# Altium schematic sheet Power.SchDoc
size A4; SheetNumber: 4; SheetTotal: 4
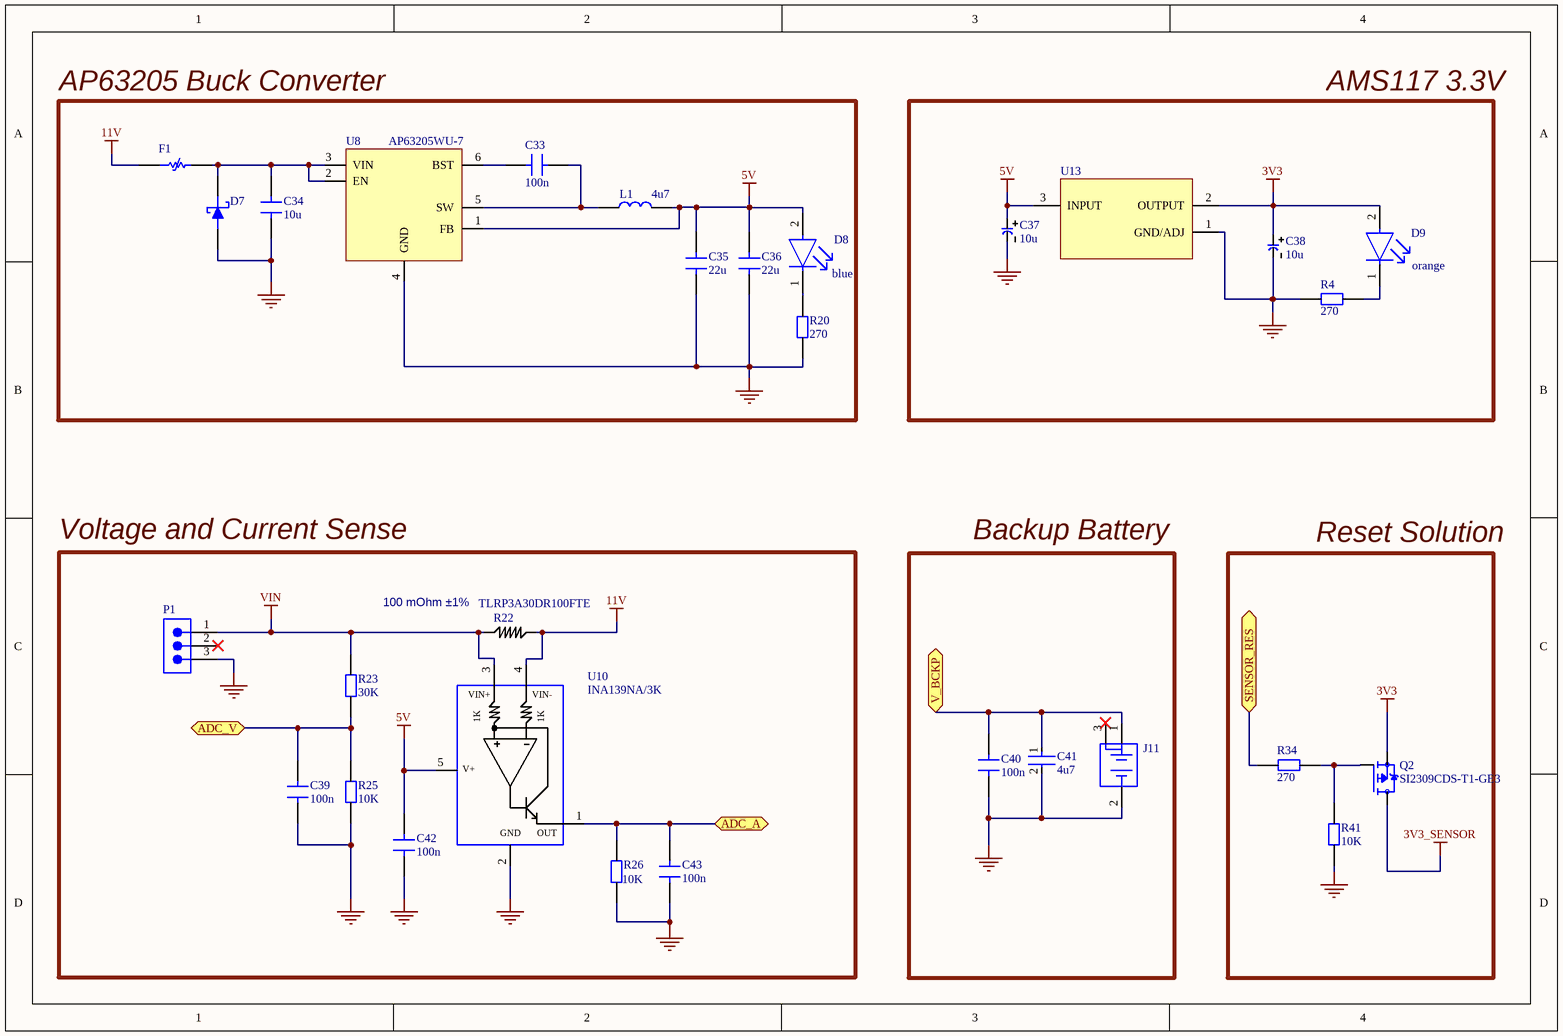
[diagram p0: Power.SchDoc]

## Parts
C33  100n  [CAP 0805]
C34  10u  [CAP 1210]
C35  22u  [CAP 1210]
C36  22u  [CAP 1210]
C37  10u  [T491A106M020AT]
C38  10u  [T491A106M020AT]
C39  100n  [CAP 0805]
C40  100n  [CAP 0603]
C41  4u7  [FP-1206-L_3_2_0_2-W_1_6_0-IPC_A]
C42  100n  [CAP 0805]
C43  100n  [CAP 0805]
D7  SMBJ14CA  [SMBJ12CA-13-F]  (value not drawn)
D8  blue  [FP-LTST-C170TBKT-MFG]
D9  orange  [FP-LTST-C170KFKT-MFG]
F1  MF-MSMF075/24-2  [0ZCG0075FF2C]  (value not drawn)
J11  S8201-46R  [S8201-46R]  (value not drawn)
L1  4u7  [IHLP2020CZER4R7M11]
P1  691382030003  [691382030003]  (value not drawn)
Q2  SI2309CDS-T1-GE3  [SI2309CDS-T1-GE3]
R4  270  [RES 0805]
R20  270  [RES 0805]
R22  TLRP3A30DR100FTE  [RES 2512]
R23  30K  [RES 0805]
R25  10K  [RES 0805]
R26  10K  [RES 0805]
R34  270  [RES 0603]
R41  10K  [RES 0603]
U8  AP63205WU-7  [AP63205]
U10  INA139NA/3K  [INA139NA]
U13  AMS111733TR-HT_SOT223  [AMS111733TR-HT_SOT223]  (value not drawn)

## Blocks framed on the sheet
AP63205 Buck Converter: C33-C36 D7 D8 F1 L1 R20 U8
AMS117 3.3V: C37 C38 D9 R4 U13
Voltage and Current Sense: C39 C42 C43 P1 R22 R23 R25 R26 U10
Backup Battery: C40 C41 J11
Reset Solution: Q2 R34 R41

## Ports
ADC_A (bidir, see MCU[4C]), ADC_V (bidir, see MCU[4B]), SENSOR_RES (bidir, see MCU[6B]), V_BCKP (bidir, see MCU[6B], Peripherals[2A])

## Nets
3V3: C38.POS D9.2(A) Q2.2(S) U13.2(OUTPUT)
3V3_SENSOR: Q2.3(D)
5V: C35.2 C36.2 C37.POS C42.2 D8.2(A) L1.2 U8.1(FB) U10.5(V+) U13.3(INPUT)
11V: F1.1 R22.1 U10.4(VIN+)
GND: C34.1 C35.1 C36.1 C37.NEG C38.NEG C39.1 C40.1 C41.2 C42.1 C43.1 D7.1 J11.2(-) P1.3 R4.2 R20.1 R25.1 R26.1 R41.1 U8.4(GND) U10.2(GND) U13.1(GND/ADJ)
VIN: P1.1 R22.2 R23.2 U10.3(VIN+)
ADC_A: C43.2 R26.2 U10.1(OUT) ; port ADC_A
ADC_V: C39.2 R23.1 R25.2 ; port ADC_V
SENSOR_RES: R34.1 ; port SENSOR_RES
V_BCKP: C40.2 C41.1 J11.1(+) ; port V_BCKP
NetC33_1: C33.1 L1.1 U8.5(SW)
NetC33_2: C33.2 U8.6(BST)
NetC34_2: C34.2 D7.2 F1.2 U8.2(EN) U8.3(VIN)
NetD8_1: D8.1(C) R20.2
NetD9_1: D9.1(C) R4.1
NetQ2_1: Q2.1(G) R34.2 R41.2

Not connected (* = marked no-connect by the designer): J11 3(+)*; P1 2*

## Notes on the sheet
- (near R22) 100 mOhm ±1%
- (in symbol INA139NA/3K) VIN-; 1K

## Library data of the parts
C33 C39 C42 C43 = CAP 0805 50V: Capacitor SMD 0805 50V
C34 = CAP 1210 50V: Capacitor SMD 1210 50V
C35 C36 = CAP 1210 25V: Capacitor SMD 1210 25V
C37 C38 = T491A106M020AT
C40 = CAP 0603 50V: Capacitor SMD 0603 50V
C41 = CMP-14477-000781-2: None; Capacitance: 4.7uF; Voltage Rating: 50V; Tolerance: 20%; Min Operating Temperature: -55°C; RoHS Compliant: Yes; Case/Package: 1206; Mount: Surface Mount; Packaging: Tape and Reel; Max Operating Temperature: 85°C; Ratings: AEC-Q200
D7 = SMBJ14CA: TVS DIODE 14VWM 23.2VC DO214AA; Manufacturer: Littelfuse; Operating Supply Voltage: 14V; Max Surge Current: 25.9A; Number of Channels: 1; Polarity: Bidirectional; Breakdown Voltage: 15.6V; Clamping Voltage: 23.2V; Peak Pulse Power: 600W; Power Line Protection: No; Test Current: 1mA; Leakage Current: 1uA; Diode Type: ZENER; Max Breakdown Voltage: 17.2V; Supplier 1: Future Electronics; Manufacturer Part Number: SMBJ14CA; RoHS: Yes; Category: TVS Diodes; Stock 1: 1300; Pricing 1: 1=0,36, 15=0,29, 75=0,245, 300=0,205, 1500=0,163 (USD); Mount: Surface Mount; Case/Package: DO-214AA; Number of Pins: 2; Weight: 0.00328oz; Min Operating Temperature: -65°C; Max Operating Temperature: 150°C; Packaging: Tape and Reel; Package Quantity: 3000; Reverse Breakdown Voltage: 15.6V; Number of Bidirectional Channels: 1; Reverse Standoff Voltage: 14V; Min Breakdown Voltage: 15.6V; Number of Elements: 1; Peak Pulse Current: 25.9A; Voltage Rating (DC): 14V; Series: SMBJ; Direction: Bidirectional; Termination: SMD/SMT; Max Power Dissipation: 600W; Power Dissipation: 600W; Current: 1mA; Voltage: 14V; Clamping Voltage-Max: 23.2V; Length: 5.59mm; Width: 3.94mm; Height: 2.44mm; RoHS Compliant: Yes; Lead Free: Lead Free; Reach SVHC Compliant: No; ComponentLink1URL: https://datasheet.ciiva.com/331/littelfuse-tvs-diode-smbj-datasheet-pdf-331530.pdf?src-supplier=Digikey; ComponentLink1Description: https://datasheet.ciiva.com/331/littelfuse-tvs-diode-smbj-datasheet-pdf-331530.pdf?src-supplier=Digikey; ComponentLink2URL: https://datasheet.ciiva.com/331/littelfuse-tvs-diode-smbj-datasheet-pdf-331531.pdf?src-supplier=Digikey; ComponentLink2Description: https://datasheet.ciiva.com/331/littelfuse-tvs-diode-smbj-datasheet-pdf-331531.pdf?src-supplier=Digikey; ComponentLink3URL: https://datasheet.ciiva.com/331/littelfuse-tvs-diode-smbj-datasheet-pdf-331529.pdf?src-supplier=Digikey; ComponentLink3Description: https://datasheet.ciiva.com/331/littelfuse-tvs-diode-smbj-datasheet-pdf-331529.pdf?src-supplier=Digikey
D8 = CMP-22017-000023-1: LED BLUE CLEAR SMD; Luminous Intensity: 180mcd; Number of LEDs: 1; Lens Style: Diffused; Power Rating: 76mW; Lens Color: Colorless; Forward Voltage: 3.8V; Viewing Angle: 130°; Reverse Voltage: 5V; Forward Current: 20mA; Dominant Wavelength: 475nm; Wavelength: 468nm; Radiation Hardening: No; Illumination Color: Blue; Case Code (Metric): 2012; Max Operating Temperature: 80°C; Case Code (Imperial): 0805; Min Operating Temperature: -20°C; Height: 1.1mm; Color: Blue; Package Quantity: 1; Lens Transparency: Clear; Number of Pins: 2; Lead Free: Lead Free; Mount: Surface Mount; Length: 2mm; Depth: 1.25mm; Number of Elements: 1; Case/Package: 0805; Power Dissipation: 76mW; Width: 1.25mm; Test Current: 20mA; Packaging: Tape and Reel
D9 = CMP-22017-000036-1: LED ORANGE CLEAR SMD; Forward Current: 30mA; Reverse Voltage: 5V; Forward Voltage: 2V; Lens Style: Diffused; Number of Elements: 1; Test Current: 20mA; Lens Color: Colorless; Viewing Angle: 130°; Dominant Wavelength: 605nm; Luminous Intensity: 60mcd; Power Rating: 75mW; Wavelength: 611nm; Min Operating Temperature: -55°C; Packaging: Tape and Reel; Case Code (Metric): 2012; Depth: 1.6mm; Case Code (Imperial): 0805; Mount: Surface Mount; Radiation Hardening: No; Lens Transparency: Clear; Color: Orange; Package Quantity: 1; Illumination Color: Orange; Lead Free: Lead Free; Number of LEDs: 1; Length: 3.2mm; Height: 1.1mm; Number of Pins: 2; Width: 1.25mm; Case/Package: 0805; Power Dissipation: 75mW; Max Operating Temperature: 85°C
F1 = MF-MSMF075/24-2: PTC Resettable Fuse 0.75A(hold) 1.5A(trip) 24V 40A 0.8W 0.2s 0.11Ohm SMD Solder Pad 1812 T/R Automotive; Manufacturer: Bourns; Supplier 1: Arrow Electronics; Manufacturer Part Number: MF-MSMF075/24-2; RoHS: Yes; Category: Fuses; Stock 1: 88000; Pricing 1: 4000=0,2686 (USD); Lead Free: 5697LeadFree; ComponentLink1URL: https://datasheet.ciiva.com/27091/1164226-27091560.pdf?src-supplier=Jameco; ComponentLink1Description: https://datasheet.ciiva.com/27091/1164226-27091560.pdf?src-supplier=Jameco; ComponentLink2URL: https://datasheet.ciiva.com/326/mfmsmf-326789.pdf?src-supplier=Digikey; ComponentLink2Description: https://datasheet.ciiva.com/326/mfmsmf-326789.pdf?src-supplier=Digikey; ComponentLink3URL: https://datasheet.ciiva.com/326/mfmsmf-326790.pdf?src-supplier=Digikey; ComponentLink3Description: https://datasheet.ciiva.com/326/mfmsmf-326790.pdf?src-supplier=Digikey; ComponentLink4URL: https://datasheet.ciiva.com/326/mfmsmf-326791.pdf?src-supplier=Digikey; ComponentLink4Description: https://datasheet.ciiva.com/326/mfmsmf-326791.pdf?src-supplier=Digikey; ComponentLink5URL: https://datasheet.ciiva.com/3019/mfmsmf-3019624.pdf?src-supplier=Avnet; ComponentLink5Description: https://datasheet.ciiva.com/3019/mfmsmf-3019624.pdf?src-supplier=Avnet; ComponentLink6URL: https://datasheet.ciiva.com/3019/mfmsmf-3019625.pdf?src-supplier=Avnet; ComponentLink6Description: https://datasheet.ciiva.com/3019/mfmsmf-3019625.pdf?src-supplier=Avnet; ComponentLink7URL: https://datasheet.ciiva.com/30254/575mfmsmf-30254266.pdf?src-supplier=Onlinecomponents.com; ComponentLink7Description: https://datasheet.ciiva.com/30254/575mfmsmf-30254266.pdf?src-supplier=Onlinecomponents.com; ComponentLink8URL: https://datasheet.ciiva.com/16205/mfmsmf-16205996.pdf?src-supplier=Onlinecomponents.com; ComponentLink8Description: https://datasheet.ciiva.com/16205/mfmsmf-16205996.pdf?src-supplier=Onlinecomponents.com; ComponentLink9URL: https://datasheet.ciiva.com/14539/70153434-14539177.pdf?src-supplier=Allied+Electronics; ComponentLink9Description: https://datasheet.ciiva.com/14539/70153434-14539177.pdf?src-supplier=Allied+Electronics; ComponentLink10URL: https://datasheet.ciiva.com/1228/1786007-1228156.pdf?src-supplier=Newark; ComponentLink10Description: https://datasheet.ciiva.com/1228/1786007-1228156.pdf?src-supplier=Newark; ComponentLink11URL: https://datasheet.ciiva.com/1274/1786007-1274502.pdf?src-supplier=Element14; ComponentLink11Description: https://datasheet.ciiva.com/1274/1786007-1274502.pdf?src-supplier=Element14; ComponentLink12URL: https://datasheet.ciiva.com/1274/1786007-1274503.pdf?src-supplier=Element14; ComponentLink12Description: https://datasheet.ciiva.com/1274/1786007-1274503.pdf?src-supplier=Element14
J11 = S8201-46R: Battery Holder, Coin Cell, 1225, Smd Rohs Compliant: Yes |Harwin S8201-46R; Manufacturer: Harwin; Number of Contacts: 2NUMBER; Supplier 1: Farnell; Manufacturer Part Number: S8201-46R; RoHS: Yes; Category: Connectors; Stock 1: 4494; Pricing 1: 1=0,926, 25=0,765, 75=0,589, 200=0,555, 500=0,48 (EUR); Contact Material: 153,154ConductorMaterial; Height: 3.25mm; ComponentLink1URL: https://datasheet.ciiva.com/4/s8201r-4048.pdf?src-supplier=Digikey; ComponentLink1Description: https://datasheet.ciiva.com/4/s8201r-4048.pdf?src-supplier=Digikey; ComponentLink2URL: https://datasheet.ciiva.com/4642/c0430120-20coin20cell20battery20retainers-55143-4642583.pdf?src-supplier=Mouser; ComponentLink2Description: https://datasheet.ciiva.com/4642/c0430120-20coin20cell20battery20retainers-55143-4642583.pdf?src-supplier=Mouser; ComponentLink3URL: https://datasheet.ciiva.com/1391/1458706-1391064.pdf?src-supplier=Element14; ComponentLink3Description: https://datasheet.ciiva.com/1391/1458706-1391064.pdf?src-supplier=Element14; ComponentLink4URL: https://datasheet.ciiva.com/4/s8201r-4049.pdf?src-supplier=Digikey; ComponentLink4Description: https://datasheet.ciiva.com/4/s8201r-4049.pdf?src-supplier=Digikey
L1 = IHLP2020CZER4R7M11: Inductor Power Shielded Wirewound 4.7uH 20% 100KHz Powdered Iron 4.5A 60mOhm DCR 2020 T/R; Manufacturer: Vishay; Supplier 1: Mouser; Manufacturer Part Number: IHLP2020CZER4R7M11; RoHS: No; Category: Fixed Inductors; Stock 1: 10031; Pricing 1: 1=1,19, 10=1,02, 50=1,02, 100=0,828, 1000=0,828, 10000=0,473 (USD); ComponentLink1URL: https://datasheet.ciiva.com/14803/lp20cz11-14803040.pdf?src-supplier=Arrow+Electronics; ComponentLink1Description: https://datasheet.ciiva.com/14803/lp20cz11-14803040.pdf?src-supplier=Arrow+Electronics; ComponentLink2URL: https://datasheet.ciiva.com/11798/0900766b8102c930-11798346.pdf?src-supplier=Rs; ComponentLink2Description: https://datasheet.ciiva.com/11798/0900766b8102c930-11798346.pdf?src-supplier=Rs; ComponentLink3URL: https://datasheet.ciiva.com/22694/480942-22694470.pdf?src-supplier=Element14; ComponentLink3Description: https://datasheet.ciiva.com/22694/480942-22694470.pdf?src-supplier=Element14; ComponentLink4URL: https://datasheet.ciiva.com/8017/480942-8017228.pdf?src-supplier=Element14; ComponentLink4Description: https://datasheet.ciiva.com/8017/480942-8017228.pdf?src-supplier=Element14; ComponentLink5URL: https://datasheet.ciiva.com/8494/lp20cz11-8494950.pdf?src-supplier=Avnet; ComponentLink5Description: https://datasheet.ciiva.com/8494/lp20cz11-8494950.pdf?src-supplier=Avnet; ComponentLink6URL: https://datasheet.ciiva.com/17112/70205433-17112327.pdf?src-supplier=Allied+Electronics; ComponentLink6Description: https://datasheet.ciiva.com/17112/70205433-17112327.pdf?src-supplier=Allied+Electronics; ComponentLink7URL: https://datasheet.ciiva.com/6688/lp20cz11-6688326.pdf?src-supplier=Digikey; ComponentLink7Description: https://datasheet.ciiva.com/6688/lp20cz11-6688326.pdf?src-supplier=Digikey; ComponentLink8URL: https://datasheet.ciiva.com/6688/lp20cz11-6688327.pdf?src-supplier=Digikey; ComponentLink8Description: https://datasheet.ciiva.com/6688/lp20cz11-6688327.pdf?src-supplier=Digikey; ComponentLink9URL: https://datasheet.ciiva.com/6688/lp20cz11-6688329.pdf?src-supplier=Digikey; ComponentLink9Description: https://datasheet.ciiva.com/6688/lp20cz11-6688329.pdf?src-supplier=Digikey
P1 = CMP-1502-01752-2: NexarPartId: 52676071; Current: 12A; Number of Levels: 1; Voltage: 300V; Pitch: 2.4892mm; Number of Positions: 3; Gender: Male; Mount: Through Hole; Contact Plating: Tin; Color: Green; Orientation: Vertical; Max Operating Temperature: 105°C; RoHS: Compliant; Min Operating Temperature: -40°C; Lead Pitch: 2.5mm; Termination: Solder; Packaging: Box; Number of Positions Per Level: 3; Number of Pins: 3
Q2 = SI2309CDS-T1-GE3: MOSFET, P-CH, Vds -60V, Vgs +/- 20V, Rds(on) 285mohm, Id 1.6A, SOT-23, Pd 1.7W | Siliconix / Vishay SI2309CDS-T1-GE3; MF: Vishay Siliconix; SnapEDA_Link: https://www.snapeda.com/parts/SI2309CDS-T1-GE3/Vishay+Siliconix/view-part/?ref=snap; Package: SOT-23-3 Vishay Siliconix; Value: *; MP: SI2309CDS-T1-GE3; Check_prices: https://www.snapeda.com/parts/SI2309CDS-T1-GE3/Vishay+Siliconix/view-part/?ref=eda
R4 R20 R23 R25 R26 = RES 0805: Resistor SMD 0805
R22 = TLRP3A30DR100FTE: Res, 0R1, 1%, 3W, Metal Strip, SMD Rohs Compliant: Yes; Manufacturer: TE Connectivity; Supplier 1: Farnell; Manufacturer Part Number: TLRP3A30DR100FTE; RoHS: No; Category: Chip SMD Resistors; Stock 1: 1580; Pricing 1: 10=0,393, 100=0,273, 500=0,221, 1000=0,179, 2000=0,177, 4000=0,166, 20000=0,163, 40000=0,159 (EUR)
R34 R41 = RES 0603: Resistor SMD 0603
U8 = AP63205WU-7: AP63205 Series 32 V 2 A 1.1 MHz Synchronous Buck Converter -TSOT-26; Manufacturer: Diodes; Max Duty Cycle: 100%; Max Supply Voltage: 32V; Min Supply Voltage: 3.8V; Nominal Supply Current: 22uA; Number of Outputs: 1NUMBER; Output Current: 2A; Output Voltage: 5V; Switching Frequency: 1.1MHz; Supplier 1: Future Electronics; Manufacturer Part Number: AP63205WU-7; RoHS: Yes; Category: Voltage Regulators - Switching; Stock 1: 45000; Pricing 1: 3000=0,33, 6000=0,32 (USD); Min Operating Temperature: -40°C; Max Operating Temperature: 85°C; Height: 1mm; ComponentLink1URL: https://www.diodes.com/assets/Datasheets/AP63200-AP63201-AP63203-AP63205.pdf?src-supplier=Digikey; ComponentLink1Description: https://www.diodes.com/assets/Datasheets/AP63200-AP63201-AP63203-AP63205.pdf?src-supplier=Digikey
U10 = INA139NA/3K: 2.7 to 36V, 440kHz Variable gain current sense amplifier 5-SOT-23 -40 to 125; Manufacturer: Texas Instruments; Supplier 1: Mouser; Manufacturer Part Number: INA139NA/3K; RoHS: Yes; Category: Amplifiers - Op Amps, Buffer, Instrumentation; Stock 1: 20541; Pricing 1: 1=1,5, 10=1,27, 50=1,27, 100=1,02, 1000=0,737, 10000=0,736 (USD); ComponentLink1URL: https://datasheet.ciiva.com/15128/getdatasheetpartid-248784-15128606.pdf?src-supplier=Verical; ComponentLink1Description: https://datasheet.ciiva.com/15128/getdatasheetpartid-248784-15128606.pdf?src-supplier=Verical; ComponentLink2URL: https://datasheet.ciiva.com/1939/ina139-1939992.pdf?src-supplier=Digikey; ComponentLink2Description: https://datasheet.ciiva.com/1939/ina139-1939992.pdf?src-supplier=Digikey; ComponentLink3URL: https://datasheet.ciiva.com/1939/ina139-1939993.pdf?src-supplier=Digikey; ComponentLink3Description: https://datasheet.ciiva.com/1939/ina139-1939993.pdf?src-supplier=Digikey; ComponentLink4URL: https://datasheet.ciiva.com/1939/ina139-1939994.pdf?src-supplier=Digikey; ComponentLink4Description: https://datasheet.ciiva.com/1939/ina139-1939994.pdf?src-supplier=Digikey; ComponentLink5URL: https://datasheet.ciiva.com/2976/ina169-2976115.pdf?src-supplier=Avnet; ComponentLink5Description: https://datasheet.ciiva.com/2976/ina169-2976115.pdf?src-supplier=Avnet
U13 = AMS111733TR-HT_SOT223: 1A output 3.3 V LDO